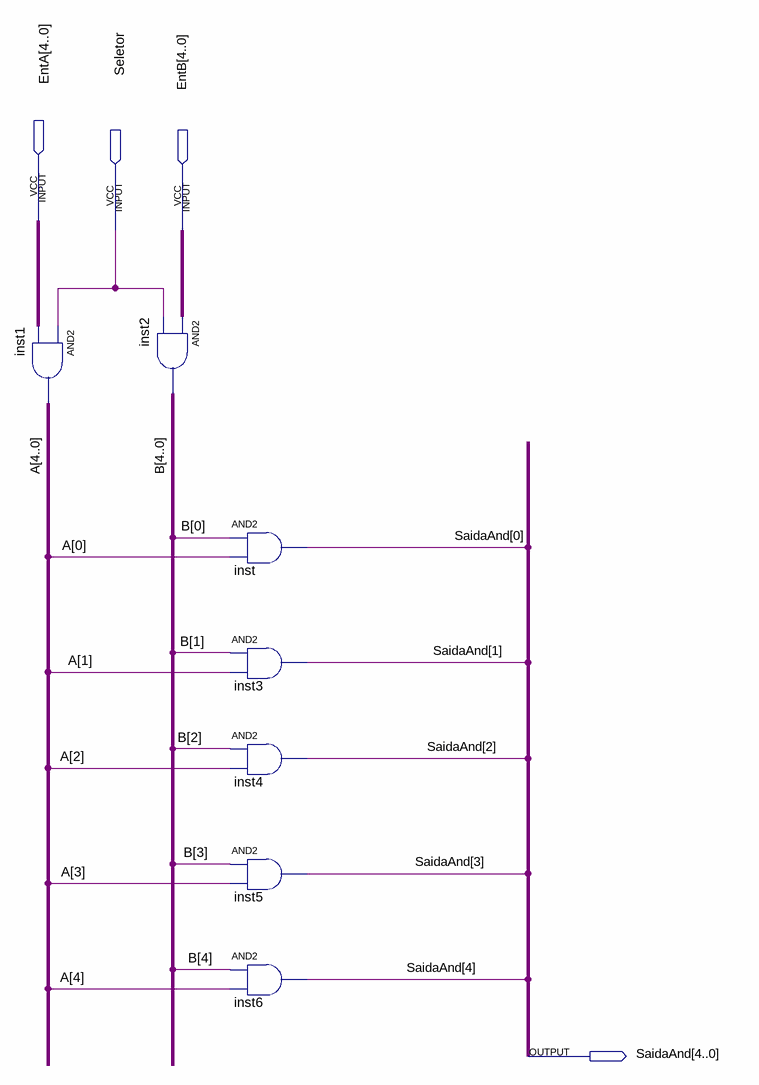
[diagram p0: schematic sheet]
// Quartus schematic PAnd.bdf as structural Verilog: 7 symbols, 4 pins
module PAnd (
  input  [4:0] EntA,
  input  Seletor,
  input  [4:0] EntB,
  output [4:0] SaidaAnd
);

  wire [4:0] A, B;

  assign A = {5{Seletor}} & EntA;  // AND2 inst1, 5 bits wide
  assign B = EntB & {5{Seletor}};  // AND2 inst2, 5 bits wide
  and inst (SaidaAnd[0], B[0], A[0]);
  and inst3 (SaidaAnd[1], B[1], A[1]);
  and inst4 (SaidaAnd[2], B[2], A[2]);
  and inst5 (SaidaAnd[3], B[3], A[3]);
  and inst6 (SaidaAnd[4], B[4], A[4]);
endmodule
